# EAGLE schematic INA3221 (EAGLE 7.6.0)
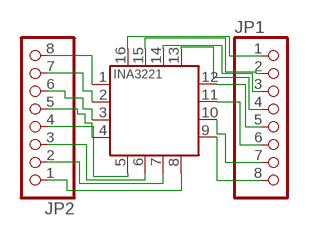
[diagram p0: schematic, sheet 1]

## Parts
JP1  PINHD-1X8BIG  [1X08-BIG]
JP2  PINHD-1X8BIG  [1X08-BIG]
U1  INA3221.  [HVQFN16_4X4]

## Nets
N$1: JP2.8 U1.1(IN-3)
N$2: JP2.7 U1.2(IN+3)
N$3: JP2.6 U1.3(GND)
N$4: JP2.5 U1.4(VS)
N$5: JP2.4 U1.5(A0)
N$6: JP2.3 U1.6(SCL)
N$7: JP2.2 U1.7(SDA)
N$8: JP2.1 U1.8(WARNING)
N$9: JP1.8 U1.9(CRITICAL)
N$10: JP1.7 U1.10(PV)
N$11: JP1.6 U1.11(IN-1)
N$12: JP1.5 U1.12(IN+1)
N$13: JP1.4 U1.13(TC)
N$14: JP1.3 U1.14(IN-2)
N$15: JP1.2 U1.15(IN+2)
N$16: JP1.1 U1.16(VPU)

## Library data of the parts
JP1 JP2 = adafruit:PINHD-1X8: PIN HEADER
U1 = INA3221:INA3221: The INA3221 is a three-channel, high-side current and bus voltage monitor with an I 2C- and SMBUScompatible interface. The INA3221 monitors both shunt voltage drops and bus supply voltages, in addition to having programmable conversion times and averaging modes for these signals. The INA3221 offers both critical and warning alerts to detect multiple programmable out-of-range conditions for each channel.